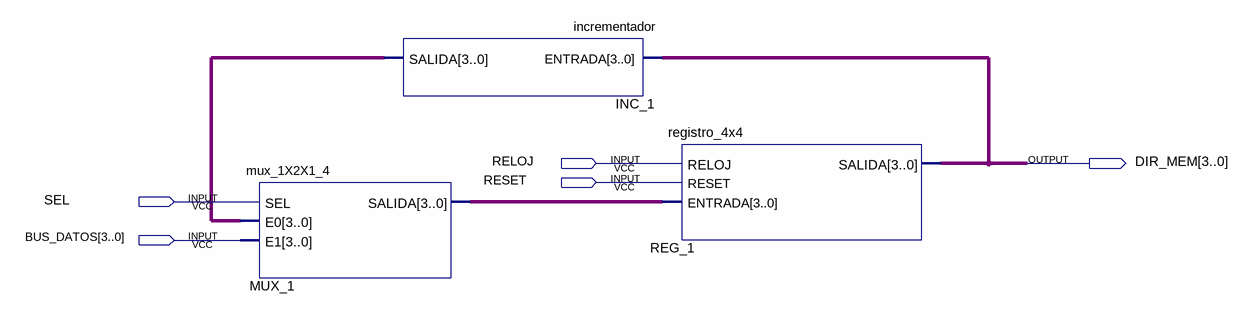
[diagram p0: schematic sheet]
// Quartus schematic secuenciador.bdf as structural Verilog: 3 symbols, 5 pins
module secuenciador (
  input  RELOJ,
  input  RESET,
  input  SEL,
  input  [3:0] BUS_DATOS,
  output [3:0] DIR_MEM
);

  wire [3:0] INC_1_salida, MUX_1_salida;

  mux_1X2X1_4 MUX_1 (.SEL(SEL), .E0(INC_1_salida), .E1(BUS_DATOS), .SALIDA(MUX_1_salida));
  incrementador INC_1 (.ENTRADA(DIR_MEM), .SALIDA(INC_1_salida));
  registro_4x4 REG_1 (.RELOJ(RELOJ), .RESET(RESET), .ENTRADA(MUX_1_salida), .SALIDA(DIR_MEM));
endmodule
